# EasyEDA schematic SCH.json
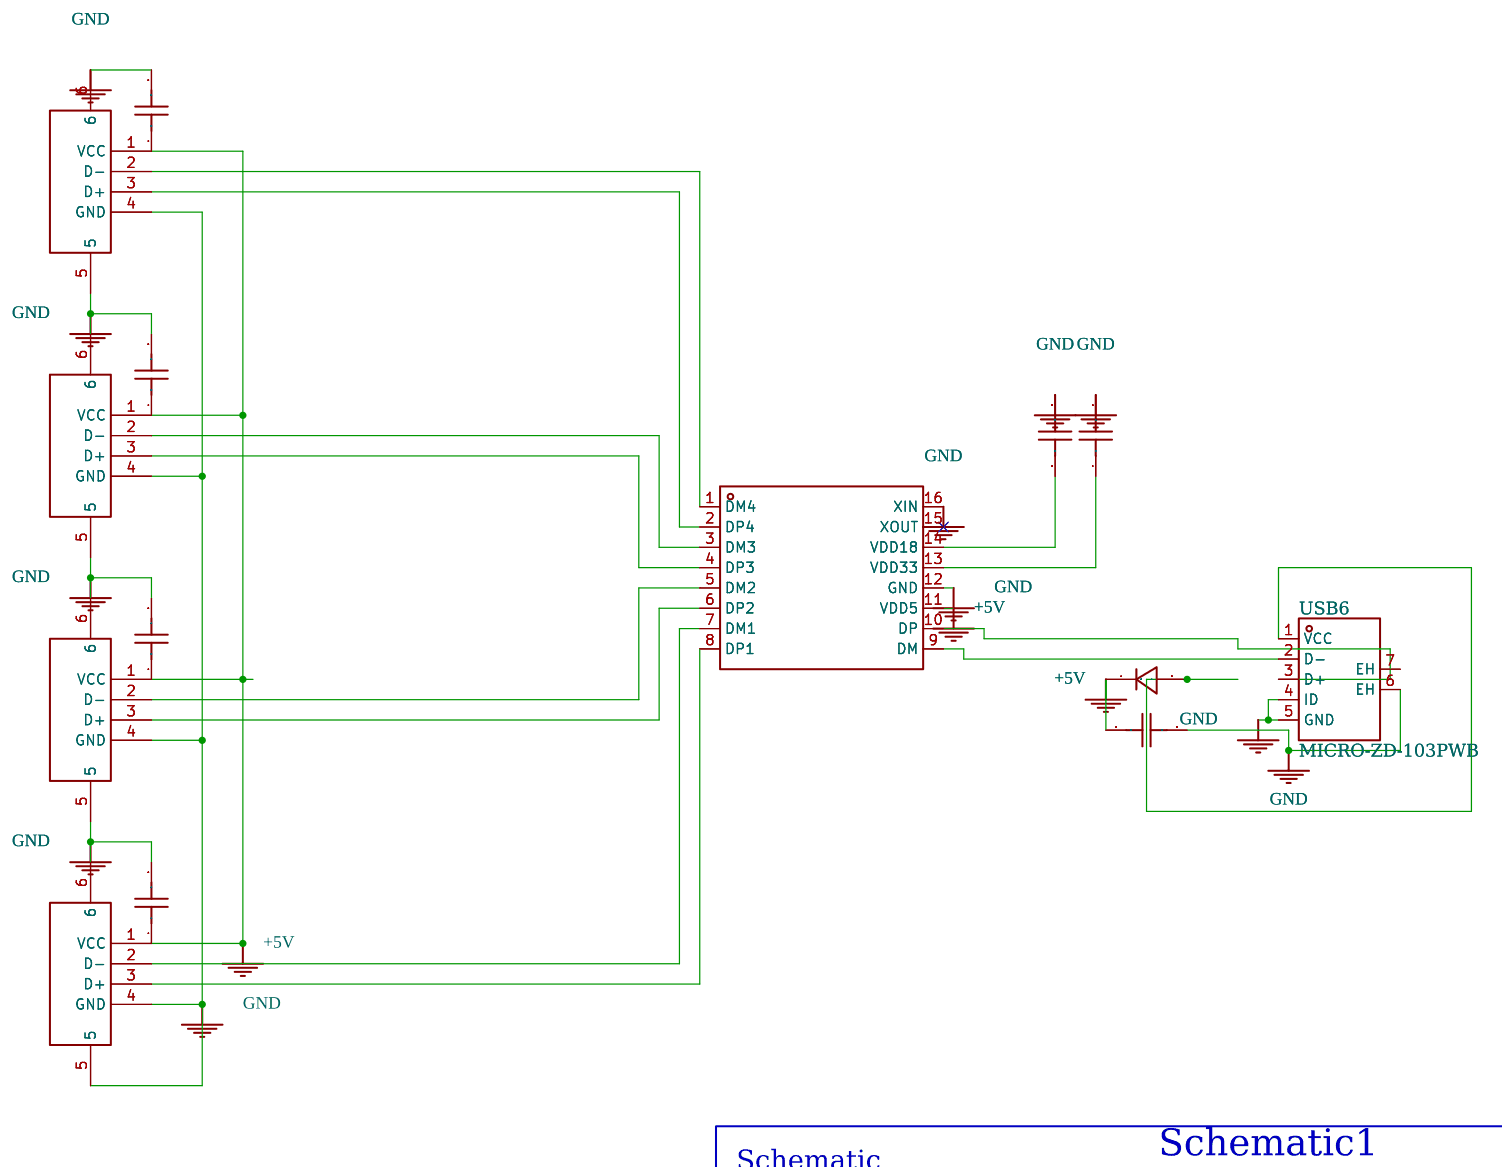
[diagram p0: schematic sheet]

## Parts
C1  10uF  [C0603]
C2  10uF  [C0603]
C3  10uF  [C0603]
C4  10uF  [C0603]
C5  10uF  [C0603]
C6  10uF  [C0603]
C7  10uF  [C0603]
D1  NSR0320MW2T1G  [SOD-323_L1.8-W1.3-LS2.5-RD]
U1  SL2.1A  [SOP-16_L10.0-W3.9-P1.27-LS6.0-BL]
USB2  903-131A1011D10100  [USB-A-TH_C46407]
USB3  903-131A1011D10100  [USB-A-TH_C46407]
USB4  903-131A1011D10100  [USB-A-TH_C46407]
USB5  903-131A1011D10100  [USB-A-TH_C46407]
USB6  MICRO-ZD-103PWB  [MICRO-USB-SMD_ZD-103PWB]

## Library data of the parts
C1-C7 = -: Symbol: CL10A106KP8NNNC; Device: CL10A106KP8NNNC; Supplier: LCSC; Manufacturer: SAMSUNG(三星); Manufacturer Part: CL10A106KP8NNNC; Supplier Part: C19702; JLCPCB Part Class: Basic Part; LCSC Part Name: 10uF ±10% 10V; Supplier Footprint: 0603; Datasheet: https://atta.szlcsc.com/upload/public/pdf/source/20160218/1457707763339.pdf; Add into BOM: yes; Convert to PCB: yes; Tolerance: ±10%
D1 = -: LCSC Part Name: 电压:20V 电流:1A; Supplier Part: C48192; Manufacturer: onsemi(安森美); Supplier Footprint: SOD-323; JLCPCB Part Class: Extended Part; Datasheet: https://atta.szlcsc.com/upload/public/pdf/source/20170225/1488010654203.PDF; Supplier: LCSC; Add into BOM: yes; Convert to PCB: yes; Forward Voltage (Vf@If): 500mV@900mA; Reverse Voltage (Vr): 20V; Average Rectified Current (Io): 1A; Reverse Leakage Current (Ir): 50uA@15V
U1 = -: LCSC Part Name: USB2.0高速4端口HUB控制器; Supplier Part: C192893; Manufacturer: CoreChips(和芯润德); Supplier Footprint: SOP-16; JLCPCB Part Class: Extended Part; Datasheet: https://atta.szlcsc.com/upload/public/pdf/source/20180522/C192893_624110D24898D57AAC785E3DF98EA862.pdf; Supplier: LCSC; Add into BOM: yes; Convert to PCB: yes
USB2-USB5 = -: Symbol: USB-AF-90-14.4X13.6-H7.0-DIP; Supplier: LCSC; Supplier Part: C46407; Manufacturer: 精拓金; LCSC Part Name: Type-A 母; Supplier Footprint: 插件; Datasheet: https://atta.szlcsc.com/upload/public/pdf/source/20210301/C46407_0FDCFD777E72B2503A3E09AE32E4643C.pdf; Add into BOM: yes; Convert to PCB: yes; Connector Type: Type-A; Standard: USB 2.0; Gender: Female; Number of Ports: 1; Number of Contacts: 4P; Current Rating - Power (Max): 1.5A
USB6 = -: Supplier Part: C5295970; Manufacturer: HDGC(华德共创); Supplier Footprint: SMD; Datasheet: https://atta.szlcsc.com/upload/public/pdf/source/20230823/560E005481561DB5EA274167A2775CD5.pdf; Supplier: LCSC; Add into BOM: yes; Convert to PCB: yes; Connector Type: Micro-B; Standard: USB 2.0; Gender: 公; Number of Ports: 1; Number of Contacts: 5P

## Nets
+5V: C1.1 C4.1 C5.1 C6.1 C7.1 D1.1(C) U1.11(VDD5) USB2.1(VCC) USB3.1(VCC) USB4.1(VCC) USB5.1(VCC)
GND: C1.2 C2.2 C3.2 C4.2 C5.2 C6.2 C7.2 U1.12(GND) U1.16(XIN) USB2.4(GND) USB2.5 USB2.6 USB3.4(GND) USB3.5 USB3.6 USB4.4(GND) USB4.5 USB4.6 USB5.4(GND) USB5.5 USB5.6 USB6.4(ID) USB6.5(GND) USB6.6(EH)
Net-(C2-1): C2.1 U1.13(VDD33)
Net-(C3-1): C3.1 U1.14(VDD18)
Net-(D1-2): D1.2(A) USB6.1(VCC)
Net-(U1-1): U1.1(DM4) USB2.2(D-)
Net-(U1-2): U1.2(DP4) USB2.3(D+)
Net-(U1-3): U1.3(DM3) USB3.2(D-)
Net-(U1-4): U1.4(DP3) USB3.3(D+)
Net-(U1-5): U1.5(DM2) USB4.2(D-)
Net-(U1-6): U1.6(DP2) USB4.3(D+)
Net-(U1-7): U1.7(DM1) USB5.2(D-)
Net-(U1-8): U1.8(DP1) USB5.3(D+)
Net-(U1-9): U1.9(DM) USB6.2(D-)
Net-(U1-10): U1.10(DP) USB6.3(D+)

Not connected (* = marked no-connect by the designer): U1 15(XOUT)*; USB6 7(EH)

## Notes on the sheet
- 1
- 2
- 3
- 4
- 5
- 6
- A
- A
- B
- B
- C
- C
- Schematic1
- Update Date
- 2024-12-18
- Schematic
- Create Date
- 2024-12-17
- P1
- Page
- Part Number
- Drawn
- usb-hub
- Reviewed
- D
- D
- VER
- SIZE
- PAGE
- 1
- OF
- 1
- EasyEDA.com
- V1.0
- A4
- 1
- 2
- 3
- 4
- 5
- 6
